# EAGLE board Erolf (EAGLE 6.5.0)
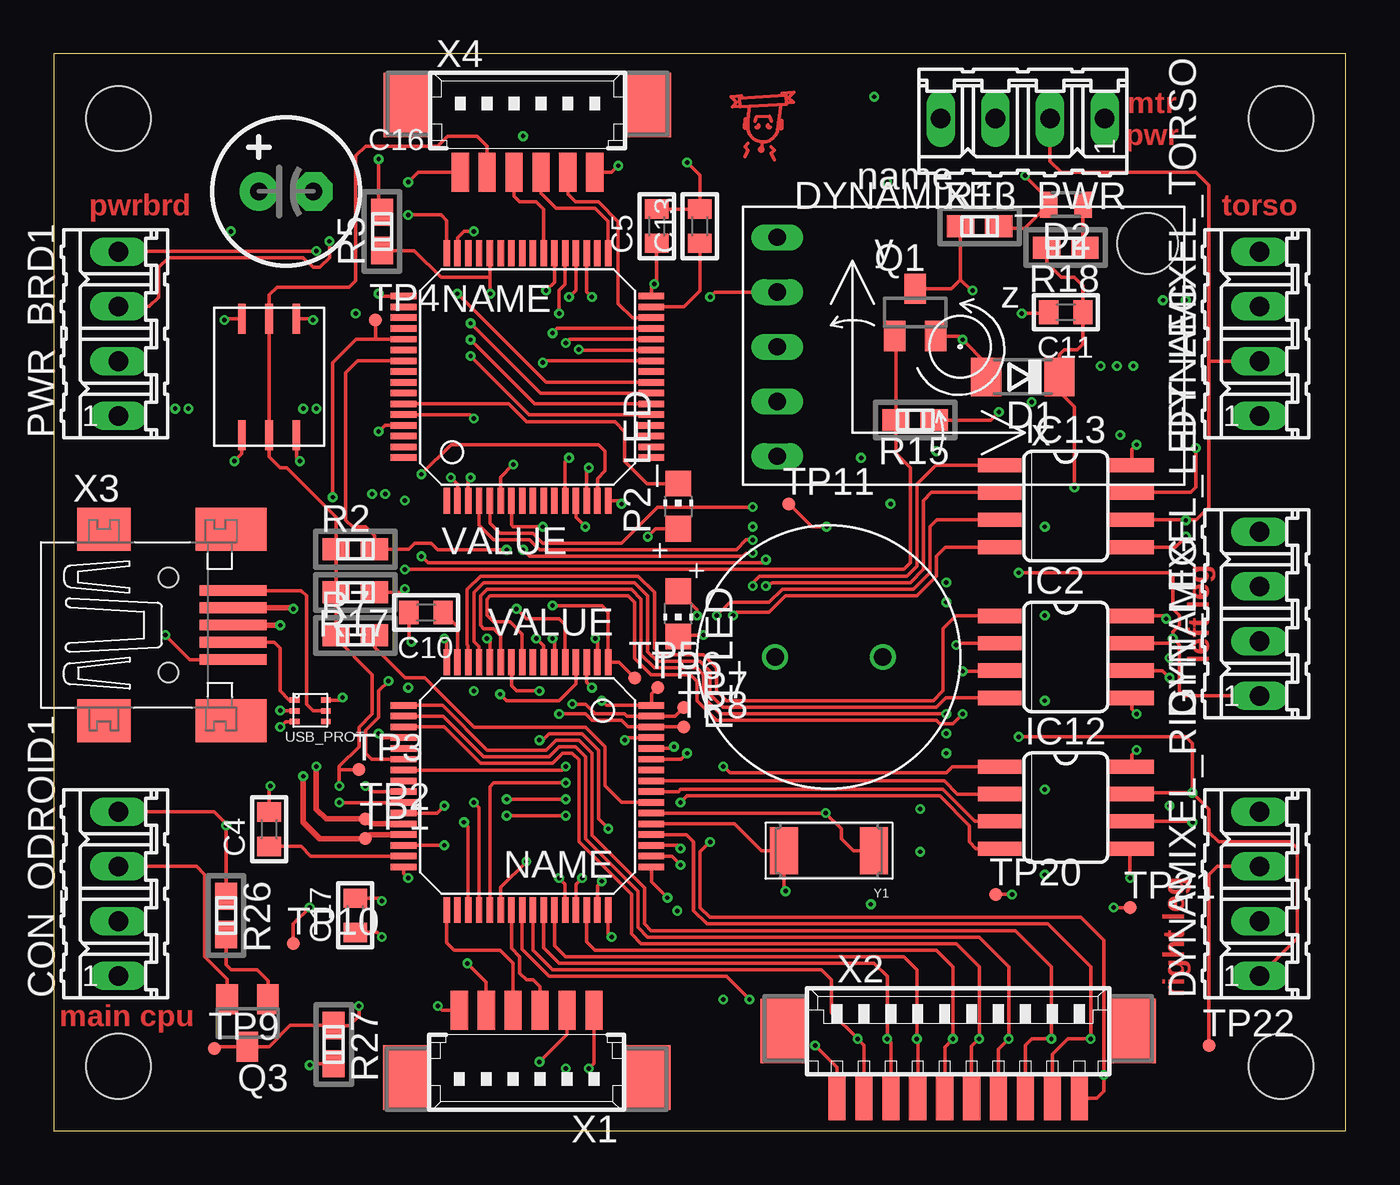
[diagram p13: board, top side]
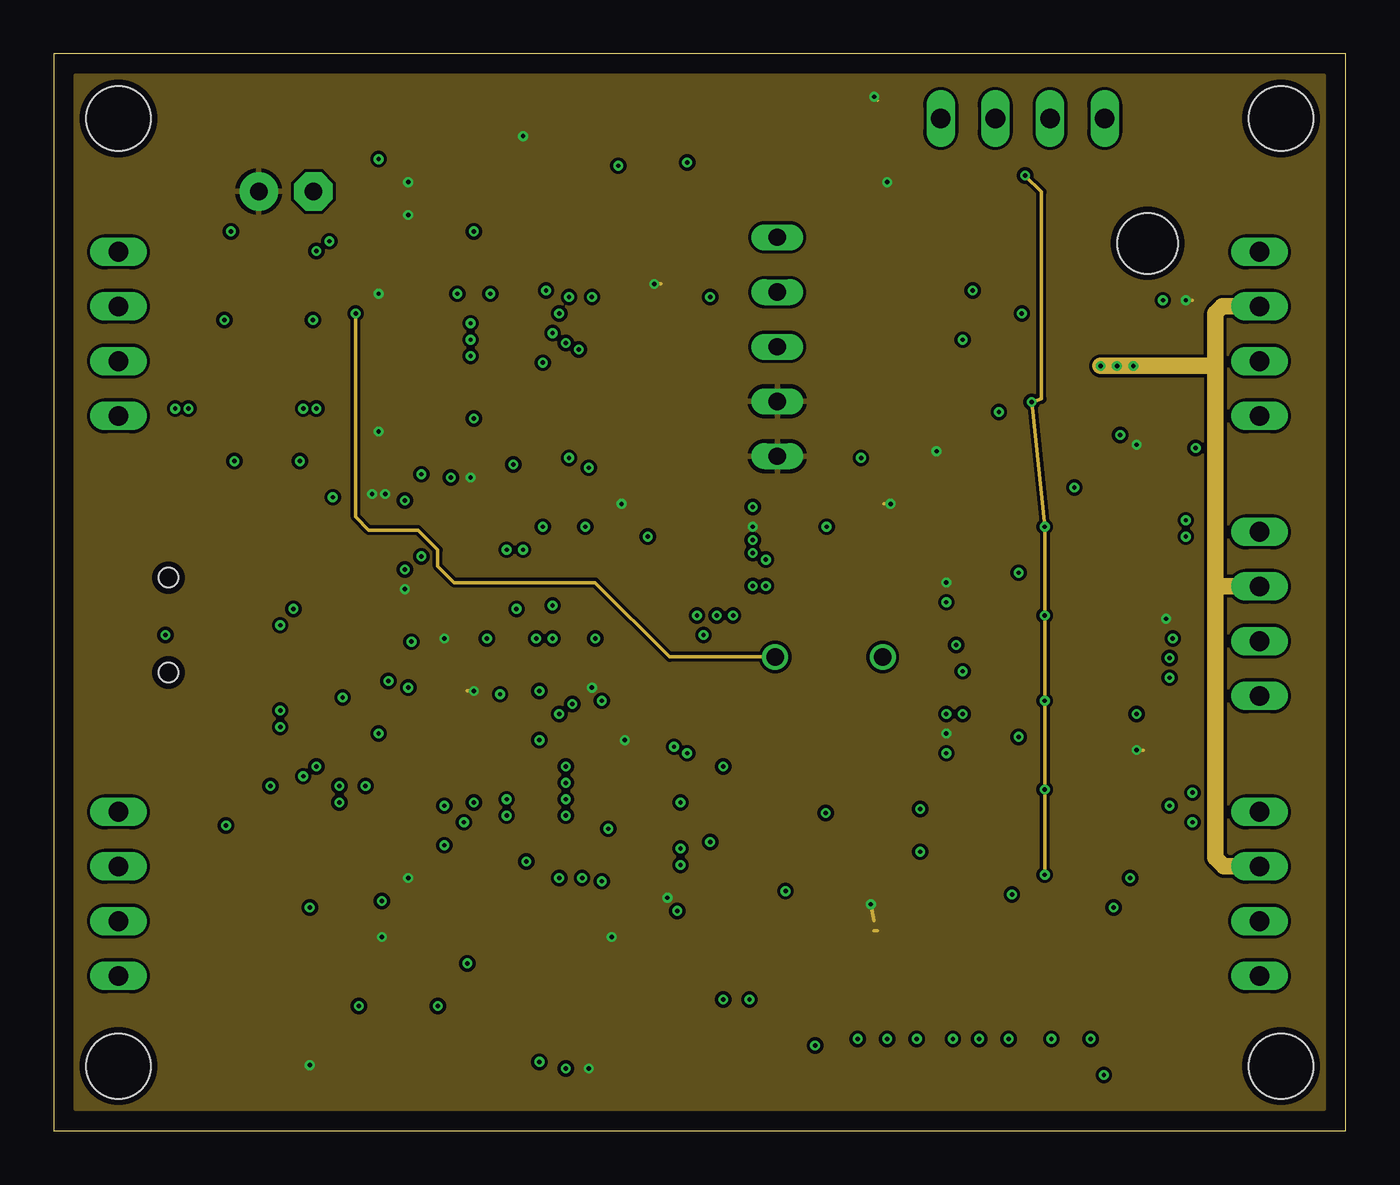
[diagram p14: board, inner layer Route2]
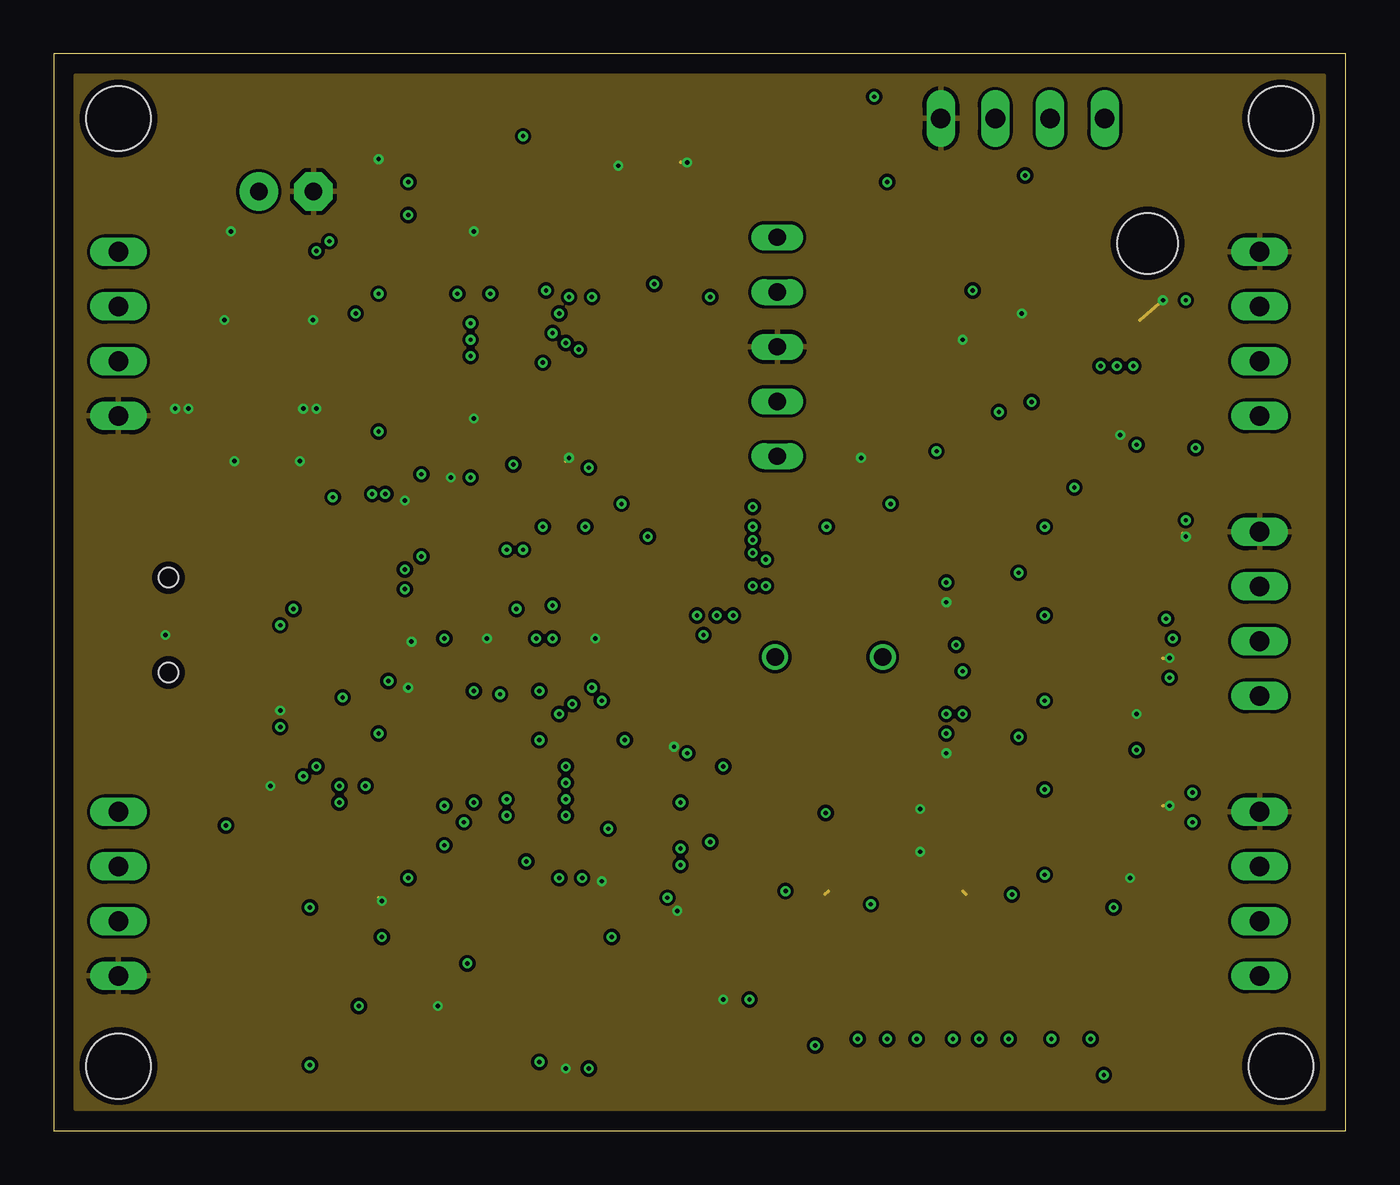
[diagram p15: board, inner layer Route15]
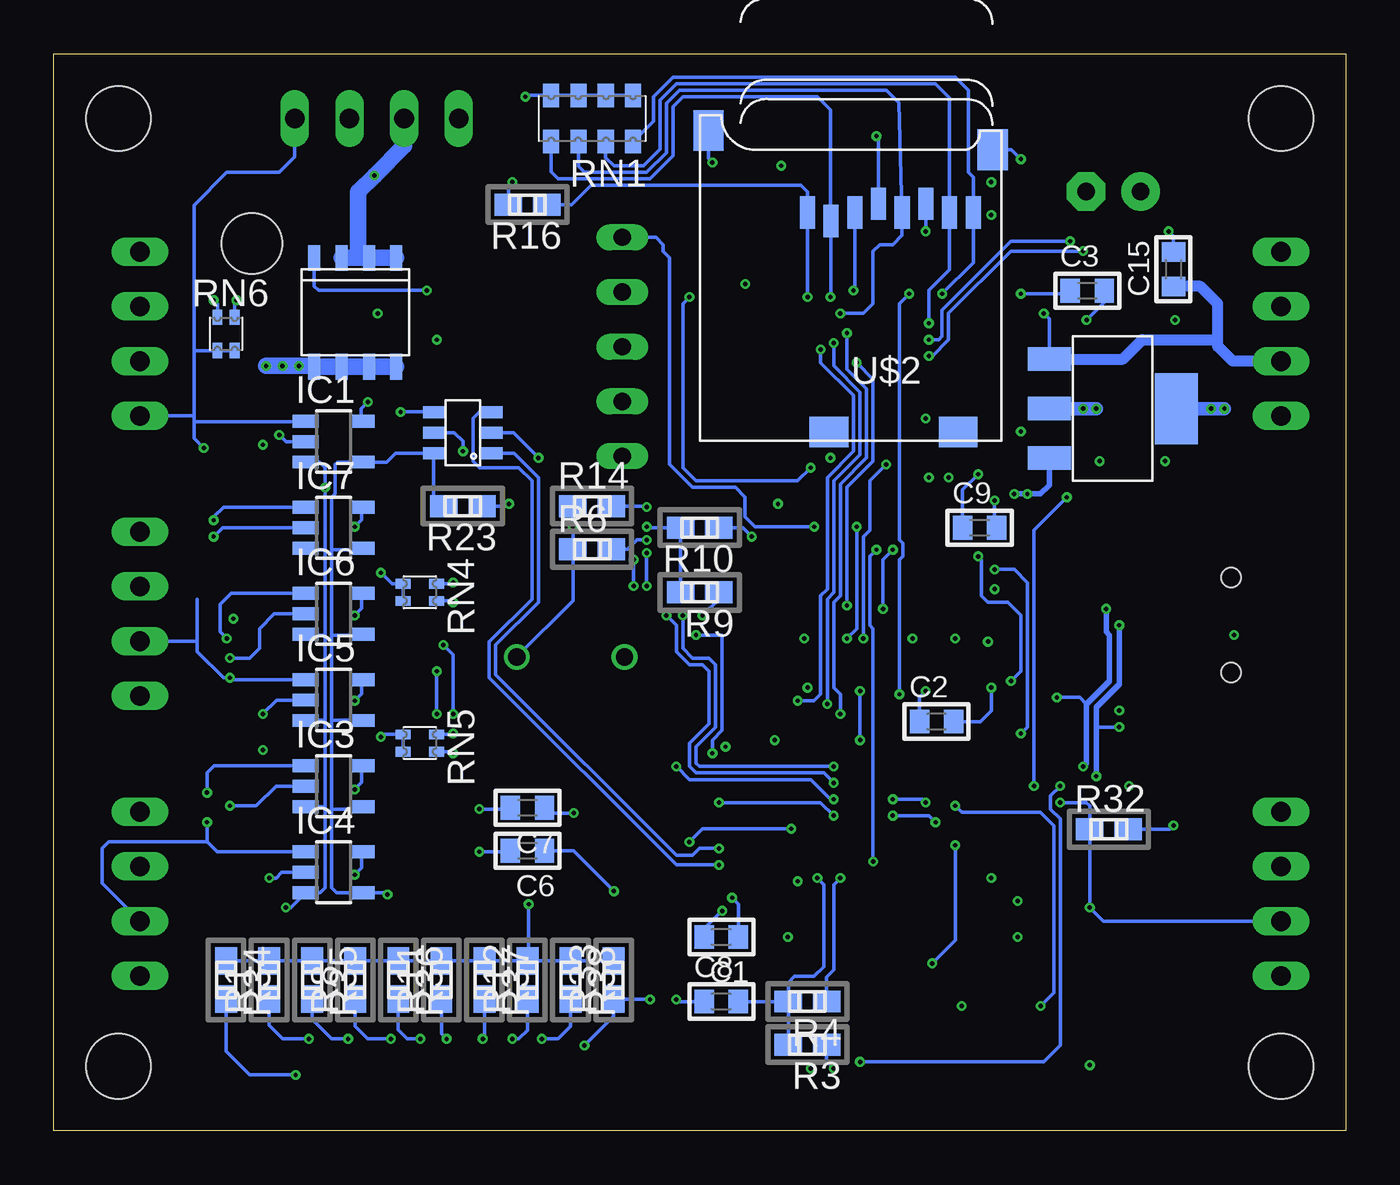
[diagram p16: board, bottom side, seen from below]

Size 60 x 50 mm. Coordinates in mm from the lower left corner, seen from the top.
Outline: 0,0 60,0 60,50 0,50 0,0
Copper layers (1+2*15+16): Top 0.035mm / dielectric 0.38mm / Route2 0.035mm / dielectric 0.71mm / Route15 0.035mm / dielectric 0.38mm / Bottom 0.035mm
Design rules "PCB-POOL HighSpec_ML4": minimum track width 0.125mm, minimum drill 0.2mm, track to track 0.125mm, track to pad 0.125mm, pad to pad 0.125mm, via to via 0.125mm, smd to smd 0.125mm, copper to edge 0.3mm, drill to drill 0.2mm, minimum pad ring 0.2mm, minimum via ring 0.125mm, stop-mask expansion 0.075mm, vias tented up to drill 0mil, thermal gap 0.2mm
Net classes: 0 default: width 0.152 mm, drill 0.203 mm, clearance 0.152 mm; 1 supply_bat: width 1.651 mm, drill 0.203 mm, clearance 0.152 mm
Holes 3 mm at 3,47 3,3 57,3 57,47

## Footprints (pad centres in the part's own frame; a part is rotated, then mirrored left to right if it is on the bottom)
SOT223-4 = smd 1.1 x 2: 1 -2.3,-2.95; 2 0,-2.95; 3 2.3,-2.95 | smd 3.3 x 2: 4 0,2.95
C0603 = smd 0.9 x 1.1: 1 -0.794,0; 2 0.794,0
CE-025X060 = drill 0.813 pad 1.778: + -1.27,0 | drill 0.813 pad 1.778 octagon: - 1.27,0
04P = drill 0.914 long: 1 -3.81,0; 2 -1.27,0; 3 1.27,0; 4 3.81,0
SOD80C = smd 1.4 x 1.8: A 1.7,0; C -1.7,0
MICROMELF-R = smd 0.8 x 1.2: A 0.8,0; C -0.8,0
DBV-R-PDSO-G5 = smd 0.6 x 1.2: 1 -0.95,-1.306; 2 0,-1.306; 3 0.95,-1.306; 4 0.95,1.306; 5 -0.95,1.306
SO08 = smd 0.66 x 2.032: 1 -1.905,-3.073; 2 -0.635,-3.073; 3 0.635,-3.073; 4 1.905,-3.073; 5 1.905,3.073; 6 0.635,3.073; 7 -0.635,3.073; 8 -1.905,3.073
CHIP-LED0805 = smd 1.2 x 1.2: A 0,-1.05; C 0,1.05
LQFP-64 = smd 0.3 x 1.2: BOOT0 -1.75,5.75; PA3 -3.75,-5.75; PA4 -2.25,-5.75; PA5 -1.75,-5.75; PA6 -1.25,-5.75; PA7 -0.75,-5.75; PA14 3.75,5.75; PA15 3.25,5.75; PB0 0.75,-5.75; PB1 1.25,-5.75; PB2 1.75,-5.75; PB3 0.75,5.75; PB4 0.25,5.75; PB5 -0.25,5.75; PB6 -0.75,5.75; PB7 -1.25,5.75; PB8 -2.25,5.75; PB9 -2.75,5.75; PB10 2.25,-5.75; PB11 2.75,-5.75; PC4 -0.25,-5.75; PC5 0.25,-5.75; PC10 2.75,5.75; PC11 2.25,5.75; PC12 1.75,5.75; PD2 1.25,5.75; VCAP_1 3.25,-5.75; VDD -2.75,-5.75; VDD1 3.75,-5.75; VDD3 -3.75,5.75; VSS -3.25,5.75; VSS0 -3.25,-5.75 | smd 1.2 x 0.3: NRST -5.75,0.75; PA0 -5.75,-2.75; PA1 -5.75,-3.25; PA2 -5.75,-3.75; PA8 5.75,0.25; PA9 5.75,0.75; PA10 5.75,1.25; PA11 5.75,1.75; PA12 5.75,2.25; PA13 5.75,2.75; PB12 5.75,-3.75; PB13 5.75,-3.25; PB14 5.75,-2.75; PB15 5.75,-2.25; PC0 -5.75,0.25; PC1 -5.75,-0.25; PC2 -5.75,-0.75; PC3 -5.75,-1.25; PC6 5.75,-1.75; PC7 5.75,-1.25; PC8 5.75,-0.75; PC9 5.75,-0.25; PC13 -5.75,3.25; PC14 -5.75,2.75; PC15 -5.75,2.25; PH0 -5.75,1.75; PH1 -5.75,1.25; VBAT -5.75,3.75; VCAP_2 5.75,3.25; VDD2 5.75,3.75; VDDA -5.75,-2.25; VSSA -5.75,-1.75
SOT23 = smd 1 x 1.4: 1 -0.95,-1.1; 2 0.95,-1.1; 3 0,1.1
R0603 = smd 1.27 x 1.016: 1 -0.889,0; 2 0.889,0
EXBS8V = smd 0.75 x 1.1: 1 -1.905,-1.07; 2 -0.635,-1.07; 3 0.635,-1.07; 4 1.905,-1.07; 5 1.905,1.07; 6 0.635,1.07; 7 -0.635,1.07; 8 -1.905,1.07
EXBV4V = smd 0.45 x 0.7: 1 -0.4,-0.775; 2 0.4,-0.775; 3 0.4,0.775; 4 -0.4,0.775
TP06R = smd 0.6 x 0.6: TP 0,0
PS1240P02CT3 = drill 0.8: P$1 -2.5,0; P$2 2.5,0
MICROSD = smd 0.7 x 1.5: 1 9,-10.64; 2 7.9,-10.24; 3 6.8,-10.64; 4 5.7,-11.04; 5 4.6,-10.64; 6 3.5,-11.04; 7 2.4,-10.64; 8 1.3,-10.64 | smd 1.8 x 1.4: CD1 2,-0.44; CD2 8,-0.44 | smd 1.4 x 1.9: MT1 0.4,-13.54; MT2 13.6,-14.44
BUTTON = smd 1.4 x 0.35: P11 -2.7,0; P12 2.7,0; P21 -2.7,1.27; P22 2.7,1.27; P23 2.7,-1.27; P24 -2.7,-1.27
PCB = drill 0.8 long: GND 1.6,6.4; SCL 1.6,11.48; SDA 1.6,8.94; VDD 1.6,1.32; VIN 1.6,3.86 | hole 2.8: 18.8,11.2
SO-8 = smd 0.559 x 1.194: P1 -1.905,-2.527; P2 -0.635,-2.527; P3 0.635,-2.527; P4 1.905,-2.527; P5 1.905,2.527; P6 0.635,2.527; P7 -0.635,2.527; P8 -1.905,2.527
DCV_R-PDSO-6 = smd 0.55 x 1: P$1 -0.95,-1.35; P$2 0,-1.35; P$3 0.95,-1.35; P$4 0.95,1.35; P$5 0,1.35; P$6 -0.95,1.35
LLP75-6L = smd 0.45 x 0.25: P$1 -0.7,1.1; P$2 -0.7,0.6; P$3 -0.7,0.1; P$4 0.75,0.1; P$5 0.75,0.6; P$6 0.75,1.1
53398-06 = smd 0.8 x 1.8: 1 3.125,-2.5; 2 1.875,-2.5; 3 0.625,-2.5; 4 -0.625,-2.5; 5 -1.875,-2.5; 6 -3.125,-2.5 | smd 2.1 x 3: S1 5.625,0.625; S2 -5.625,0.625
53261-10 = smd 0.8 x 2: 1 5.625,-2.5; 2 4.375,-2.5; 3 3.125,-2.5; 4 1.875,-2.5; 5 0.625,-2.5; 6 -0.625,-2.5; 7 -1.875,-2.5; 8 -3.125,-2.5; 9 -4.375,-2.5; 10 -5.625,-2.5 | smd 2.1 x 3: S1 8.125,0.625; S2 -8.125,0.625
32005-301 = smd 3.1 x 0.5: 1 3,1.6; 2 3,0.8; 3 3,0; 4 3,-0.8; 5 3,-1.6 | smd 2.5 x 2: M1 -3,-4.45; M2 -3,4.45 | smd 3.3 x 2: M3 2.9,4.45; M4 2.9,-4.45 | hole 0.9: 0,2.2; 0,-2.2
CRYSTAL_4.9X1.8 = smd 1.3 x 2.2: 1 -2.1,0; 2 2.1,0

## Placement (x,y rotation side)
BLUBB  [SOT223-4]  10.82,33.53 270 bottom
C1  2.2uF  [C0603]  29,9 180 bottom
C2  2.2uF  [C0603]  19,19 0 bottom
C3  2.2uF  [C0603]  12,39 0 bottom
C4  2.2uF  [C0603]  10,14 90 top
C5  2.2uF  [C0603]  28,42 90 top
C6  22pF  [C0603]  38,13 180 bottom
C7  22pF  [C0603]  38,15 180 bottom
C8  100nF  [C0603]  29,6 0 bottom
C9  2.2uF  [C0603]  17,28 0 bottom
C10  2.2uF  [C0603]  17.29,24.06 180 top
C11  100nF  [C0603]  47,38 180 top
C13  2.2uF  [C0603]  30,42 90 top
C15  100nF  [C0603]  8,40 90 bottom
C16  10uF  [CE-025X060]  10.79,43.61 0 top
C17  100nF  [C0603]  14,10 90 top
CON_ODROID1  [04P]  3,11 90 top
D1  [SOD80C]  45,35 180 top
D2  [MICROMELF-R]  47,43 180 top
DYNAMIXEL_LEFT_LEG  [04P]  56,24 90 top
DYNAMIXEL_PWR  [04P]  45,47 180 top
DYNAMIXEL_RIGHT_LEG  [04P]  56,11 90 top
DYNAMIXEL_TORSO  [04P]  56,37 90 top
IC1  TL331  [DBV-R-PDSO-G5]  47,32 270 bottom
IC2  MAX481CSA  [SO08]  47,22 270 top
IC3  TL331  [DBV-R-PDSO-G5]  47,16 270 bottom
IC4  TL331  [DBV-R-PDSO-G5]  47,12 270 bottom
IC5  TL331  [DBV-R-PDSO-G5]  47,20 270 bottom
IC6  TL331  [DBV-R-PDSO-G5]  47,24 270 bottom
IC7  TL331  [DBV-R-PDSO-G5]  47,28 270 bottom
IC12  MAX481CSA  [SO08]  47,15 270 top
IC13  MAX481CSA  [SO08]  47,29 270 top
P1_LED  [CHIP-LED0805]  29,24 180 top
P2_LED  [CHIP-LED0805]  29,29 0 top
PROCESSOR_1  STM32-F405RB  [LQFP-64]  22,16 180 top
PROCESSOR_2  STM32-F405RB  [LQFP-64]  22,35 0 top
PWR_BRD1  [04P]  3,37 90 top
Q1  BSS123  [SOT23]  40,38 0 top
Q3  [SOT23]  9,5 180 top
R1  330R  [R0603]  50,7 90 bottom
R2  47k  [R0603]  14,27 0 top
R3  100k  [R0603]  25,4 180 bottom
R4  1k  [R0603]  25,6 180 bottom
R5  10k  [R0603]  15.24,41.76 90 top
R6  330R  [R0603]  35,27 0 bottom
R7  47k  [R0603]  14,23 0 top
R8  330R  [R0603]  46,7 90 bottom
R9  330R  [R0603]  30,25 180 bottom
R10  330R  [R0603]  30,28 180 bottom
R11  330R  [R0603]  42,7 90 bottom
R12  330R  [R0603]  38,7 90 bottom
R13  10kR  [R0603]  43,42 0 top
R14  330R  [R0603]  35,29 0 bottom
R15  1kR  [R0603]  40,33 180 top
R16  33kR  [R0603]  38,43 180 bottom
R17  10k  [R0603]  14,25 180 top
R18  10kR  [R0603]  47,41 180 top
R23  10kR  [R0603]  41,29 180 bottom
R26  0k  [R0603]  8,10 270 top
R27  5k  [R0603]  13,4 270 top
R32  5k  [R0603]  11,14 0 bottom
R33  330R  [R0603]  34,7 90 bottom
R34  10kR  [R0603]  52,7 270 bottom
R35  10kR  [R0603]  48,7 270 bottom
R36  10kR  [R0603]  44,7 270 bottom
R37  10kR  [R0603]  40,7 270 bottom
R38  10kR  [R0603]  36,7 270 bottom
RN1  33kR  [EXBS8V]  35,47 180 bottom
RN4  10k  [EXBV4V]  43,25 270 bottom
RN5  10k  [EXBV4V]  43,18 270 bottom
RN6  10k  [EXBV4V]  52,37 0 bottom
TP1  PTR1TP06R  [TP06R]  14.48,13.56 0 top
TP2  PTR1TP06R  [TP06R]  14.48,14.48 0 top
TP3  PTR1TP06R  [TP06R]  14.17,16.76 0 top
TP4  PTR1TP06R  [TP06R]  14.94,37.64 0 top
TP5  PTR1TP06R  [TP06R]  26.97,21.03 0 top
TP6  PTR1TP06R  [TP06R]  28.04,20.57 0 top
TP7  PTR1TP06R  [TP06R]  29.26,19.66 0 top
TP8  PTR1TP06R  [TP06R]  29.26,18.75 0 top
TP9  PTR1TP06R  [TP06R]  7.47,3.81 0 top
TP10  PTR1TP06R  [TP06R]  11.13,8.69 0 top
TP11  PTR1TP06R  [TP06R]  34.14,29.11 0 top
TP20  PTR1TP06R  [TP06R]  43.74,10.97 0 top
TP21  PTR1TP06R  [TP06R]  49.99,10.36 0 top
TP22  PTR1TP06R  [TP06R]  53.64,3.96 0 top
U$1  [PS1240P02CT3]  36,22 0 top
U$2  MICROSD  [MICROSD]  16,32 180 bottom
U$3  [BUTTON]  10,35 270 top
U$4  MINI-IMU-9V2  [PCB]  32,30 0 top
U$6  SI4459ADY  [SO-8]  46,38 180 bottom
U$7  [DCV_R-PDSO-6]  41.01,32.41 90 bottom
U$8  [LOGO]  32.96,46.83 180 top
USB_PROT  VBUS054B  [LLP75-6L]  11.89,18.9 0 top
X1  53398-06  [53398-06]  21.96,3.09 180 top
X2  53261-10  [53261-10]  42,4 0 top
X3  MINI-USB-32005-301  [32005-301]  5.33,23.48 0 top
X4  53398-06  [53398-06]  22,47 0 top
Y1  8MHz  [CRYSTAL_4.9X1.8]  36,13 180 top

## Tracks (layer width: path | path; a pad name or v marks a point on that pad's centre or on a via)
BOOT0_CHARGE_P1  (via drill 0.2)
  Top 0.152: PROCESSOR_1.PB8 24.25,11.45 v24.54,11.73
  Bottom 0.152: v24.54,11.73 24.23,11.43 24.23,7.62 24.69,7.16 25.6,7.16 25.89,6.88 R4.2 | C8.2 R4.2 | R4.2 R3.2
BOOT_P2  (via drill 0.2)
  Top 0.152: PROCESSOR_2.BOOT0 20.25,39.62 | 20.25,39.62 20.25,38.88 v20.27,38.86 | PROCESSOR_1.PA4 24.25,20.75 23.47,19.96 21.03,19.96 v20.73,20.27 | R5.1 16.74,40.87 17.98,39.62 20.25,39.62
  Bottom 0.152: v20.27,38.86 20.73,38.41 20.73,27.43 20.57,27.28 20.57,26.67 20.73,26.52 v20.73,20.27
DYNAMIXEL_BUS_OFF  (via drill 0.2)
  Top 0.152: Q1.1 39.11,36.84 R15.2 39.11,31.45 39.78,30.79 39.78,26.36 39.47,26.06 v16.31,26.06 | PROCESSOR_1.PB15 15.28,18.25 v15.09,18.44
  Bottom 0.152: v15.09,18.44 14.78,18.75 14.78,25.45 15.39,26.06 v16.31,26.06
DYNAMIXEL_BUS_OFF_AUTO_TRIG  (via drill 0.2)
  Top 0.152: TP20.TP v44.5,10.97
  Bottom 0.152: 47.09,14.94 47.09,11.28 46.86,11.05 IC4.4 44.58,11.05 v44.5,10.97 | 47.09,14.94 47.09,19.05 | 47.09,19.05 47.09,23.01 | 47.09,23.01 47.09,26.98 | 47.09,26.98 47.09,29.41 46.94,29.57 46.94,30.94 46.83,31.05 IC1.4 44.54,31.05 44.13,31.46 U$7.P$6 42.36,29.47 R23.2 | IC5.4 47.09,19.05 | IC3.4 45.81,14.94 47.09,14.94 | IC6.4 45.73,23.01 47.09,23.01 | IC7.4 45.77,26.98 47.09,26.98
DYNAMIXEL_LEFT_LEG_A  (via drill 0.2)
  Top 0.152: IC2.6 51.48,21.36 v51.82,21.03
  Bottom 0.152: 53.34,24.69 53.34,22.71 | 53.34,22.71 53.34,22.25 52.12,21.03 v51.82,21.03 51.73,20.95 IC5.1 48.38,20.88 | DYNAMIXEL_LEFT_LEG.2 53.36,22.73 53.34,22.71
DYNAMIXEL_LEFT_LEG_B  (via drill 0.2)
  Top 0.152: IC2.7 51.74,22.64 v51.97,22.86 | v44.81,25.91 51.82,25.91 51.97,25.76 51.97,24.23 52.27,23.93 52.27,23.47 51.97,23.16 v51.97,22.86 | DYNAMIXEL_LEFT_LEG.1 52.51,20.19 52.27,20.42 52.27,22.55 v51.97,22.86
  Bottom 0.152: IC6.1 51.77,24.95 52.27,24.45 52.27,23.16 v51.97,22.86 | RN4.2 RN4.1 44.3,25.4 v44.81,25.91
DYNAMIXEL_LEFT_LEG_DXE  (via drill 0.2)
  Top 0.152: PROCESSOR_1.PC5 21.75,23.06 21.18,23.62 20.42,23.62 20.12,23.93 20.12,24.69 20.27,24.84 26.67,24.84 26.98,24.54 26.98,21.95 27.74,21.18 29.57,21.18 29.87,20.88 29.87,19.96 30.79,19.05 41,19.05 41.15,18.9 41.76,18.9 v42.22,19.36 | v42.22,21.34 43.9,21.34 IC2.3
  Bottom 0.152: v42.22,19.36 v42.22,21.34
DYNAMIXEL_LEFT_LEG_RX
  Top 0.152: IC2.1 41.89,23.91 41.3,23.32 41.3,20.42 40.84,19.96 31.24,19.96 30.79,20.42 30.79,21.49 30.18,22.1 28.19,22.1 27.89,22.4 27.89,24.99 27.13,25.76 19.81,25.76 19.2,25.15 19.2,22.55 19.25,22.51 PROCESSOR_1.PB11
DYNAMIXEL_LEFT_LEG_RXE  (via drill 0.2)
  Top 0.152: PROCESSOR_1.PB1 20.75,22.99 20.42,23.32 19.96,23.32 19.81,23.47 19.81,24.84 20.12,25.15 26.82,25.15 27.28,24.69 27.28,22.1 27.89,21.49 29.87,21.49 30.18,21.18 30.18,20.12 30.94,19.36 v41.45,19.36 | v41.91,22.55 41.99,22.64 IC2.2
  Bottom 0.152: v41.45,19.36 41.45,22.1 v41.91,22.55
DYNAMIXEL_LEFT_LEG_TX
  Top 0.152: PROCESSOR_1.PB10 19.75,22.46 19.51,22.71 19.51,24.99 19.96,25.45 26.98,25.45 27.58,24.84 27.58,22.25 28.04,21.79 30.02,21.79 30.48,21.34 30.48,20.27 31.09,19.66 41,19.66 41.43,20.09 IC2.4
DYNAMIXEL_PWR_RST_CLK  (via drill 0.2)
  Top 0.152: PROCESSOR_1.PC14 28.96,13.25 v29.11,13.11
  Bottom 0.152: v29.11,13.11 30.02,13.11 30.33,12.8 31.09,12.8 39.47,21.18 39.47,22.55 37.49,24.54 37.49,30.33 38.62,31.46 U$7.P$1
DYNAMIXEL_PWR_RST_D  (via drill 0.2)
  Top 0.152: PROCESSOR_1.PC13 28.7,12.75 v29.11,12.34
  Bottom 0.152: v29.11,12.34 31.09,12.34 39.78,21.03 39.78,22.71 37.8,24.69 37.8,30.18 38.41,30.79 40.23,30.79 40.54,31.09 40.54,33.07 40.25,33.36 U$7.P$3
DYNAMIXEL_RIGHT_LEG_A  (via drill 0.2)
  Top 0.152: IC12.6 52.84,14.37 v52.88,14.33
  Bottom 0.152: IC4.1 52.42,12.95 52.88,13.41 | 52.88,13.41 v52.88,14.33 | 52.88,13.41 57.45,13.41 57.76,13.11 57.76,11.49 DYNAMIXEL_RIGHT_LEG.2
DYNAMIXEL_RIGHT_LEG_B  (via drill 0.2)
  Top 0.152: v44.81,18.29 52.58,18.29 52.88,17.98 v52.88,15.7 | DYNAMIXEL_RIGHT_LEG.1 57.76,8.95 57.76,13.11 57.45,13.41 54.1,13.41 53.65,13.87 53.65,14.94 v52.88,15.7 | IC12.7 50.14,15.7 v52.88,15.7
  Bottom 0.152: v44.81,18.29 44.69,18.4 RN5.1 RN5.2 | IC3.1 52.54,16.95 52.88,16.61 v52.88,15.7
DYNAMIXEL_RIGHT_LEG_DXE
  Top 0.152: IC12.3 42.78,14.37 41.3,15.85 29.11,15.85 29.01,15.75 PROCESSOR_1.PC0
DYNAMIXEL_RIGHT_LEG_RX  (via drill 0.2)
  Top 0.152: IC12.1 41.75,16.91 41.45,16.61 31.39,16.61 v31.09,16.92 | v23.77,15.39 v21.03,15.39 | v19.51,15.24 19.75,15 PROCESSOR_1.PC11
  Bottom 0.152: v31.09,16.92 30.48,16.31 24.84,16.31 23.93,15.39 v23.77,15.39 | v21.03,15.39 19.66,15.39 v19.51,15.24
DYNAMIXEL_RIGHT_LEG_RXE
  Top 0.152: PROCESSOR_1.PC1 41.36,16.25 41.97,15.63 IC12.2
DYNAMIXEL_RIGHT_LEG_TX  (via drill 0.2)
  Top 0.152: IC12.4 42.84,13.1 42.52,13.41 42.52,14.17 41.15,15.54 29.41,15.54 v29.11,15.24 | v23.77,14.63 v21.03,14.63 | v19.05,14.33 19.25,14.13 PROCESSOR_1.PC10
  Bottom 0.152: v29.11,15.24 24.38,15.24 v23.77,14.63 | v21.03,14.63 19.36,14.63 v19.05,14.33
DYNAMIXEL_TORSO_A  (via drill 0.2)
  Top 0.152: 52.58,28.36 53.05,28.36 53.65,28.96 53.65,35.66 | 52.58,28.36 IC13.6 | v52.58,28.35 52.58,28.36 | 53.65,35.66 53.65,43.89 53.03,44.5 46.79,44.5 46.27,45.02 DYNAMIXEL_PWR.2 | DYNAMIXEL_TORSO.2 53.71,35.73 53.65,35.66
  Bottom 0.152: IC7.1 52.12,28.96 52.58,28.5 v52.58,28.35
DYNAMIXEL_TORSO_B  (via drill 0.2)
  Top 0.152: IC13.7 52.8,29.64 53.03,29.87 v53.03,31.7
  Bottom 0.152: 53.49,36.23 RN6.1 RN6.2 | IC1.1 48.33,32.95 48.36,32.92 53.49,32.92 | v53.03,31.7 53.49,32.16 53.49,32.92 | 53.49,32.92 53.49,33.22 | 53.49,33.22 53.49,36.23 | DYNAMIXEL_TORSO.1 53.53,33.19 53.49,33.22 | 53.49,36.23 53.49,42.98 51.97,44.5 49.53,44.5 48.81,45.22 DYNAMIXEL_PWR.1
DYNAMIXEL_TORSO_DXE  (via drill 0.2)
  Top 0.152: IC13.3 41.01,28.36 40.69,28.04 40.69,25.91 39.93,25.15 33.83,25.15 33.22,24.54 31.39,24.54 v30.79,23.93 | v23.77,16.92 23.61,16.75 PROCESSOR_1.PC8
  Bottom 0.152: v30.79,23.93 30.79,22.4 30.33,21.95 29.57,21.95 29.26,21.64 29.26,18.75 30.18,17.83 30.18,17.07 30.02,16.92 v23.77,16.92
DYNAMIXEL_TORSO_RX  (via drill 0.2)
  Top 0.152: IC13.1 40.96,30.91 40.08,30.02 40.08,26.21 39.62,25.76 32.77,25.76 32.46,25.45 v32.46,25.3 | v32.46,26.82 32.16,26.82 32,26.67 22.1,26.67 v21.79,26.98 | v21.95,12.5 20.75,11.3 PROCESSOR_1.PD2
  Bottom 0.152: v32.46,25.3 v32.46,26.82 | v21.79,26.98 22.1,26.67 22.1,23.47 21.95,23.32 v21.95,12.5
DYNAMIXEL_TORSO_RXE  (via drill 0.2)
  Top 0.152: IC13.2 40.76,29.64 40.39,29.26 40.39,26.06 39.78,25.45 33.38,25.45 v33.07,25.3 | v33.07,26.52 32.92,26.36 17.37,26.36 v17.07,26.67 | PROCESSOR_1.PC7 14.75,17.25 14.48,17.53 14.48,18.59 15.09,19.2 15.09,20.42 v15.54,20.88
  Bottom 0.152: v33.07,25.3 v33.07,26.52 | v17.07,26.67 16.92,26.52 16.92,24.84 16.61,24.54 15.7,24.54 15.09,23.93 15.09,21.34 v15.54,20.88
DYNAMIXEL_TORSO_TX  (via drill 0.2)
  Top 0.152: IC13.4 41.42,27.09 41,26.67 41,25.76 40.08,24.84 33.98,24.84 33.22,24.08 31.7,24.08 v31.55,23.93 | v23.77,16.15 20.42,16.15 20.25,15.98 PROCESSOR_1.PC12
  Bottom 0.152: v31.55,23.93 31.09,23.47 31.09,22.25 30.48,21.64 29.87,21.64 29.57,21.34 29.57,18.9 30.48,17.98 30.48,16.92 30.18,16.61 24.23,16.61 v23.77,16.15
GND  (via drill 0.2)
  Top 0.152: PROCESSOR_2.VSS 18.75,41.46 19.05,41.76 v19.51,41.76 | X4.1 25.91,44.5 v26.21,44.81 | U$3.P24 7.98,37.7 v7.92,37.64 | U$3.P21 11.98,37.7 v12.04,37.64 | U$3.P23 8.73,31.44 v8.38,31.09 | U$3.P22 11.27,31.25 v11.43,31.09 | PROCESSOR_2.VSSA 19.33,33.25 v19.51,33.07 | PROCESSOR_2.VSS0 18.75,30.02 v18.44,30.33 | PROCESSOR_2.PB2 23.75,31.07 v23.93,31.24 | Q1.2 42.04,36.9 v42.22,36.73 43.3,35.64 D1.A | IC13.5 52.09,27.09 v52.58,27.58 | v49.99,11.73 49.99,13.01 IC12.5 | IC2.5 50.07,19.57 v50.29,19.36 | PROCESSOR_1.PB2 20.25,22.73 v20.12,22.86 | PROCESSOR_1.VSS0 25.25,22.76 v25.15,22.86 | C17.2 15.11,10.79 v15.24,10.67 | X1.1 18.03,5.59 v17.83,5.79 | PROCESSOR_1.VSS 25.25,11.38 v25.45,11.58 | PROCESSOR_1.VSSA 28.72,17.75 v28.8,17.83 | v29.41,44.96 30,44.37 C13.2 C5.2 | C10.2 16.49,22.82 v16.61,22.71 | R5.2 15.09,42.8 v15.09,45.11 | C4.2 10,15.94 v10.06,16 | USB_PROT.P$2 11.33,19.51 v10.52,19.51 | X3.5 6.31,21.88 v5.18,23.01 | C11.2 46.15,37.95 v44.96,37.95
  Route2 0.152: v16.46,20.57 16.61,20.57
  Route15 0.152: v19.51,41.76 19.51,41.91 | v15.09,45.11 15.09,44.96 | v26.21,44.81 26.36,44.81 | v29.41,44.96 29.11,44.96 | v8.23,41.76 8.38,41.76 | v7.92,37.64 7.77,37.64 | v12.04,37.64 12.19,37.64 | v8.38,31.09 8.23,31.09 | v11.43,31.09 11.58,31.09 | v12.19,33.53 12.04,33.53 | v19.51,33.07 19.51,32.92 | v18.44,30.33 18.44,30.48 | v23.93,31.24 23.77,31.09 | v51.51,38.56 50.44,37.64 | v49.53,32.31 49.38,32.31 | v42.22,36.73 42.06,36.73 | v37.49,31.24 37.49,31.39 | v52.58,27.58 52.43,27.74 | v41.45,24.54 41.3,24.54 | v41.45,17.53 41.3,17.53 | 42.37,10.97 42.22,11.12 | v51.82,15.09 51.51,15.09 | v51.82,21.95 51.51,21.95 | v20.12,22.86 19.96,22.86 | v25.15,22.86 24.99,22.86 | v15.24,10.67 15.09,10.82 | v17.83,5.79 17.68,5.79 | v23.77,2.9 23.62,2.9 | v31.09,6.1 31.09,6.25 | v25.45,11.58 25.45,11.73 | v28.8,17.83 28.96,17.83 | 35.97,11.12 35.81,10.97
  Bottom 0.152: U$2.MT1 15.52,45.54 v15.09,45.11 | U$2.6 v19.5,41.77 v19.51,41.76 | U$2.MT2 29.6,45.15 v29.41,44.96 | C15.2 8,41.53 v8.23,41.76 | v11.58,33.53 v12.19,33.53 | IC1.2 49.22,32 v49.53,32.31 | U$7.P$2 38.66,32.41 v37.49,31.24 | IC7.2 52.16,28 v52.58,27.58 | RN4.3 41.52,24.6 v41.45,24.54 | RN5.3 41.53,17.6 v41.45,17.53 | IC3.2 49.68,16 50.6,15.09 v51.82,15.09 | v49.99,11.73 49.68,11.73 49.42,12 IC4.2 | v50.29,19.36 49.65,20 IC5.2 | IC6.2 49.76,24 50.44,23.32 50.44,22.4 50.9,21.95 v51.82,21.95 | R3.1 24.11,3.23 v23.77,2.9 | C8.1 30.99,6 v31.09,6.1 | RN6.3 51.6,38.47 v51.51,38.56 | C2.2 16.97,19 16.46,19.51 v16.46,20.57 | C9.2 16.31,28.1 v16.31,29.26 | C7.2 38.86,14.94 v40.23,14.94 | C6.2 38.84,12.95 v40.23,12.95 | C3.2 11.21,38.48 v12.04,37.64 | C1.2 29.79,9.37 v28.96,10.21
  Bottom 0.635: BLUBB.4 v5.64,33.53 | BLUBB.2 v11.58,33.53
  other vias: 6.25,33.53
  pour Route15 (isolate 0.152): 1,1 1,49 59,49 59,1
IMU_SCL  (via drill 0.2)
  Top 0.152: v24.69,28.04 24.25,28.48 PROCESSOR_2.PB10
  Bottom 0.152: U$4.SCL 32.03,41.48 31.7,41.15 31.7,40.84 31.39,40.54 31.39,30.94 30.33,29.87 28.35,29.87 27.89,29.41 27.89,28.5 27.43,28.04 v24.69,28.04
IMU_SDA  (via drill 0.2)
  Top 0.152: U$4.SDA 30.71,38.94 v30.48,38.71 | v24.84,30.79 24.75,30.69 PROCESSOR_2.PB11
  Bottom 0.152: v30.48,38.71 30.79,38.41 30.79,30.79 30.18,30.18 25.45,30.18 v24.84,30.79
MISC_3  (via drill 0.2)
  Top 0.152: PROCESSOR_1.PA6 23.25,22.77 v23.16,22.86 | v22.71,28.04 21.34,28.04 21.25,28.13 PROCESSOR_2.PA7
  Bottom 0.152: v23.16,22.86 22.71,23.32 v22.71,28.04
MISC_4  (via drill 0.2)
  Top 0.152: PROCESSOR_1.PA7 22.75,22.51 v22.4,22.86 | v21.34,30.94 20.75,30.35 PROCESSOR_2.PA6
  Bottom 0.152: v21.34,30.94 22.1,30.18 22.1,27.89 22.4,27.58 v22.4,22.86
N$1
  Top 0.152: C10.1 18.75,23.39 PROCESSOR_1.VCAP_1
N$2  (via drill 0.2)
  Top 0.152: R15.1 43.52,33 v43.89,33.38
  Bottom 0.152: v43.89,33.38 42.38,33.38 U$7.P$4
N$3  (via drill 0.2)
  Top 0.152: v29.87,23.93 29.87,24.18 P1_LED.A
  Bottom 0.152: R9.1 29.11,24.69 v29.87,23.93
N$4  (via drill 0.2)
  Top 0.152: P2_LED.A 27.95,27.95 v27.58,27.58
  Bottom 0.152: v27.58,27.58 28,28 R10.1
N$5  (via drill 0.2)
  Top 0.152: P1_LED.C 29.06,23.01 v30.18,23.01 | v29.41,17.53 29.14,17.25 PROCESSOR_1.PC3
  Bottom 0.152: v30.18,23.01 28.96,23.01 28.96,18.59 29.41,18.14 v29.41,17.53
N$7
  Top 0.152: C13.1 30,38.99 29.26,38.25 PROCESSOR_2.VCAP_2
N$8  (via drill 0.2)
  Top 0.152: PROCESSOR_2.VCAP_1 25.25,30.28 25.6,30.63 25.6,31.55 25.3,31.85 18.44,31.85 v17.07,30.48
  Bottom 0.152: v17.07,30.48 17.79,29.75 C9.1
N$9  (via drill 0.2)
  Top 0.152: PROCESSOR_1.BOOT0 23.75,11.45 v23.47,11.73
  Bottom 0.152: v23.47,11.73 23.77,11.43 23.77,7.47 24.11,7.13 R4.1
N$10
  Top 0.152: PROCESSOR_2.PC3 21.11,33.75 21.95,32.92 26.06,32.92 26.52,32.46 26.52,31.09 27.56,30.05 P2_LED.C
N$11  (via drill 0.2)
  Top 0.152: R13.1 42.11,39.52 | 42.11,39.52 41.69,39.1 Q1.3 | 42.11,39.52 42.62,39.01 v42.67,39.01
  Bottom 0.152: v42.67,39.01 47.7,39.01 47.91,39.22 U$6.P4
N$12
  Top 0.152: D2.C 47.8,41.09 R18.1
N$15
  Top 0.152: R26.2 8,7.7 8.23,7.47 9.45,7.47 9.95,6.97 Q3.1
N$43
  Top 0.152: PROCESSOR_1.VCAP_2 11.94,12.75 11.48,13.21 C4.1
NRST  (via drill 0.2)
  Top 0.152: R7.1 R17.2 R2.1 13.11,28.49 10.82,30.79 10.52,30.79 10,31.3 U$3.P12 U$3.P11 10,38.8 10.36,39.17 13.72,39.17 14.02,39.47 14.02,45.26 14.48,45.72 17.83,45.72 18.29,46.18 19.66,46.18 20.12,45.71 X4.5 | R7.1 12.95,22.84 | 13.26,16.76 v13.26,16 | v22.55,3.2 23.84,4.48 X1.5 | TP3.TP 13.26,16.76 | 13.26,16.76 13.26,16.92 14.17,17.83 14.17,18.75 14.78,19.36 14.78,21.18 13.11,22.86 R7.1
  Bottom 0.152: v13.26,16 13.72,15.54 13.72,14.94 13.26,14.48 13.26,3.96 14.02,3.2 v22.55,3.2
NRST_P1_SAV
  Top 0.152: PROCESSOR_1.NRST 26.38,15.25 25.6,16.02 25.6,17.83 24.69,18.75 19.51,18.75 17.22,21.03 16.31,21.03 14.89,22.45 R7.2
NRST_P2  (via drill 0.2)
  Top 0.152: PROCESSOR_2.NRST 14.11,35.75 13.56,35.2 13.56,28.35 13.87,28.04 14.48,28.04 14.89,27.63 R2.2 16.48,27 16.76,27.28 17.53,27.28 17.83,26.98 v21.03,26.98 | PROCESSOR_1.PA5 23.75,23.49 23.47,23.77 21.95,23.77 v21.49,24.23
  Bottom 0.152: v21.49,24.23 21.49,26.52 v21.03,26.98
OBC_P1_2_P2  (via drill 0.2)
  Top 0.152: PROCESSOR_2.PA10 24.41,36.25 v24.38,36.27 | v25.45,19.96 25.66,19.75 PROCESSOR_1.PA2 27.75,20.28 TP6.TP
  Bottom 0.152: v24.38,36.27 24.38,35.66 22.86,34.14 22.86,31.55 24.08,30.33 24.08,25.15 24.38,24.84 24.38,20.27 24.69,19.96 v25.45,19.96
OBC_P2_2_P1  (via drill 0.2)
  Top 0.152: v23.16,24.38 25.45,24.38 25.75,24.09 PROCESSOR_1.PA3 26.26,21.75 TP5.TP | v22.71,35.66 22.8,35.75 PROCESSOR_2.PA9
  Bottom 0.152: v23.16,24.38 23.16,29.87 21.95,31.09 21.95,34.9 v22.71,35.66
OSC_IN  (via drill 0.2)
  Top 0.152: PROCESSOR_1.PH0 31.62,14.25 32.87,13 Y1.2 33.9,11.21 v33.98,11.12
  Bottom 0.152: C6.1 35.86,13 v33.98,11.12
OSC_OUT  (via drill 0.2)
  Top 0.152: PROCESSOR_1.PH1 v35.85,14.75 36.58,14.02 36.58,13.56 37.14,13 Y1.1
  Bottom 0.152: C7.1 36.96,14.75 v35.85,14.75
P1_SGN_PCKT  (via drill 0.2)
  Top 0.152: PROCESSOR_2.PA11 23.95,36.75 v23.77,36.58 | v24.08,19.81 24.69,19.81 25.15,19.36 26.52,19.36 26.62,19.25 PROCESSOR_1.PA1 28.85,19.25 TP7.TP
  Bottom 0.152: v23.77,36.58 23.77,35.51 22.55,34.29 22.55,31.39 23.77,30.18 23.77,24.99 24.08,24.69 v24.08,19.81
P2_SGN_PCKT  (via drill 0.2)
  Top 0.152: PROCESSOR_2.PA12 23.38,37.25 v23.16,37.03 | v23.47,19.36 24.69,19.36 24.99,19.05 26.36,19.05 26.66,18.75 PROCESSOR_1.PA0 TP8.TP
  Bottom 0.152: v23.16,37.03 23.16,35.36 22.25,34.44 22.25,31.24 23.47,30.02 23.47,24.84 23.77,24.54 23.77,20.57 23.47,20.27 v23.47,19.36
PWR_BRD_RX  (via drill 0.2)
  Top 0.152: PWR_BRD1.3 4.44,38.27 4.88,38.71 4.88,40.08 5.33,40.54 11.58,40.54 12.04,40.08 12.34,40.08 12.8,40.54 v12.8,41.3 | v19.36,36.73 22.33,33.75 PROCESSOR_2.PC7
  Bottom 0.152: v12.8,41.3 15.54,41.3 18.75,38.1 18.75,36.88 18.9,36.73 v19.36,36.73
PWR_BRD_TX  (via drill 0.2)
  Top 0.152: v12.19,40.84 3.03,40.84 PWR_BRD1.4 | v19.36,35.97 22.07,33.25 PROCESSOR_2.PC6
  Bottom 0.152: v12.19,40.84 15.54,40.84 18.44,37.95 18.44,36.73 19.2,35.97 v19.36,35.97
SD_CLK  (via drill 0.2)
  Top 0.152: PROCESSOR_2.PC12 23.75,39.3 23.47,39.01 v23.47,37.95
  Bottom 0.152: v23.47,37.95 22.4,37.95 21.95,38.41 21.95,40.84 21.64,41.15 21.03,41.15 20.6,41.58 U$2.5 20.75,47.73 21.34,48.31 30.94,48.31 31.55,47.7 31.55,45.41 32.46,44.5 35.36,44.5 35.63,44.78 RN1.6
SD_CMD  (via drill 0.2)
  Top 0.152: PROCESSOR_2.PD2 23.25,39.4 v22.86,39.01
  Bottom 0.152: v22.86,39.01 22.8,39.07 U$2.3
SD_D0  (via drill 0.2)
  Top 0.152: v19.36,37.49 22.59,34.25 PROCESSOR_2.PC8
  Bottom 0.152: v19.36,37.49 19.36,39.01 18.4,39.97 U$2.7 18.4,47.97 19.05,48.62 31.09,48.62 31.85,47.85 31.85,45.57 32.61,44.81 33.98,44.81 34.37,45.19 RN1.7
SD_D1  (via drill 0.2)
  Top 0.152: v18.75,38.86 22.86,34.75 PROCESSOR_2.PC9
  Bottom 0.152: v18.75,38.86 17.3,40.31 U$2.8 17.3,44.27 17.53,44.5 17.53,48.31 18.14,48.92 31.24,48.92 32.16,48.01 32.16,46.87 RN1.8
SD_D2  (via drill 0.2)
  Top 0.152: PROCESSOR_2.PC10 24.75,38.95 v24.99,38.71
  Bottom 0.152: v24.99,38.71 v25,38.72 U$2.1 24.99,43.59 25.3,43.89 35.05,43.89 35.94,43 R16.1
SD_D3  (via drill 0.2)
  Top 0.152: PROCESSOR_2.PC11 24.25,39.03 v23.93,38.71
  Bottom 0.152: v23.93,38.71 23.9,38.74 U$2.2 23.93,42.27 23.93,47.4 24.54,48.01 30.79,48.01 31.24,47.55 31.24,45.26 32.31,44.2 36.58,44.2 36.91,44.52 RN1.5
SER_FROM_ODROID  (via drill 0.2)
  Top 0.152: PROCESSOR_1.PA10 17.8,14.75 v18.14,15.09 | v14.17,5.79 14.17,5.33 13.72,4.88 13.01,4.88 R27.1 10.98,4.89 10,3.9 Q3.3 7.56,3.9 TP9.TP
  Bottom 0.152: v18.14,15.09 17.83,14.78 14.17,14.78 13.56,14.17 13.56,6.4 v14.17,5.79
SER_TO_ODROID  (via drill 0.2)
  Top 0.152: v13.26,15.24 PROCESSOR_1.PA9 | v11.89,10.36 11.12,9.6 TP10.TP
  Bottom 0.152: CON_ODROID1.2 11.25,9.73 v11.89,10.36 R32.1 | v13.26,15.24 12.04,15.24 11.89,15.09 R32.1 | R32.1
SLAVE_CLK  (via drill 0.2)
  Top 0.152: PROCESSOR_1.PA8 14.73,15.75 v14.48,16 | v12.95,29.41 12.95,35.66 14.04,36.75 14.94,36.75 | 14.94,36.75 PROCESSOR_2.PH0 | TP4.TP 14.94,36.75
  Bottom 0.152: v14.48,16 14.48,27.89 v12.95,29.41
SND_SIG  (via drill 0.2)
  Top 0.152: TP11.TP 35.2,28.04 v35.89,28.04
  Bottom 0.152: U$1.P$2 35.89,24.61 R6.1 v35.89,28.04 R14.1
SND_SIG_1  (via drill 0.2)
  Top 0.152: PROCESSOR_2.PA4 19.75,28.1 20.42,27.43 22.1,27.43 22.55,26.98 31.7,26.98 32.16,27.43 v32.46,27.43
  Bottom 0.152: v32.46,27.43 32.92,27.43 33.35,27 R6.2
SND_SIG_2  (via drill 0.2)
  Top 0.152: PROCESSOR_2.PA5 20.25,28.21 20.73,27.74 22.25,27.74 22.71,27.28 26.36,27.28 28.04,28.96 v32.46,28.96
  Bottom 0.152: R14.2 32.51,29 v32.46,28.96
SWCLK_P1
  Top 0.152: PROCESSOR_1.PA14 18.25,8.72 18.59,8.38 20.73,8.38 21.34,7.77 X1.3
SWCLK_P2
  Top 0.152: X4.3 22.62,43.52 23.32,42.82 25.15,42.82 25.75,42.22 PROCESSOR_2.PA14
SWDIO_P1  (via drill 0.2)
  Top 0.152: PROCESSOR_1.PA13 18.13,13.25 v18.14,13.26 | v19.2,7.77 20.09,6.89 X1.2
  Bottom 0.152: v18.14,13.26 18.14,8.84 v19.2,7.77
SWDIO_P2
  Top 0.152: X4.2 23.88,43.49 24.23,43.13 25.3,43.13 26.21,42.22 26.21,38.41 26.87,37.75 PROCESSOR_2.PA13
TRACESWO_P1
  Top 0.152: PROCESSOR_1.PB3 21.25,8.47 21.64,8.08 21.64,7.32 21.95,7.01 22.25,7.01 22.59,6.68 X1.4
TRACESWO_P2
  Top 0.152: X4.4 21.38,43.4 21.64,43.13 22.4,43.13 22.75,42.78 PROCESSOR_2.PB3
TX_ODROID
  Top 0.152: CON_ODROID1.3 6.63,12.27 7.01,11.89 7.01,8.08 8.05,7.04 Q3.2
USB_DM  (via drill 0.2)
  Top 0.152: USB_PROT.P$6 13.29,20 v13.41,20.12
  Top 0.254: PROCESSOR_1.PA11 14.71,14.25 TP2.TP 12.65,14.48 12.19,14.94 v12.19,16.92 | X3.2 11.08,24.28 v11.12,24.23
  Bottom 0.152: v13.41,20.12 12.34,20.12 12.04,19.81
  Bottom 0.254: v11.12,24.23 11.12,23.16 10.97,23.01 10.97,20.88 12.04,19.81 12.04,17.07 v12.19,16.92
USB_DP  (via drill 0.2)
  Top 0.152: USB_PROT.P$3 10.77,19 v10.52,18.75
  Top 0.254: PROCESSOR_1.PA12 14.66,13.75 TP1.TP 12.34,13.56 11.58,14.33 v11.58,16.46 | X3.3 10.51,23.48 v10.52,23.47
  Bottom 0.152: v10.52,18.75 11.58,18.75
  Bottom 0.254: v10.52,23.47 10.52,20.73 11.58,19.66 11.58,18.75 v11.58,16.46
USB_ID
  Top 0.152: X3.4 10.24,22.68 10.52,22.4 10.52,20.42 10.94,20 USB_PROT.P$1
USB_VBUS
  Top 0.152: X3.1 11.5,25.08 11.73,24.84 11.73,19.81 12.05,19.5 USB_PROT.P$5
USR_BTN1_A  (via drill 0.2)
  Top 0.152: PROCESSOR_1.PB5 22.25,8.38 23.16,7.47 35.66,7.47 36.12,7.01 36.12,5.49 v37.34,4.27 37.62,3.98 X2.9
  Bottom 0.152: v37.34,4.27 36.58,4.27 36,4.84 R38.2
USR_BTN1_K  (via drill 0.2)
  Top 0.152: PROCESSOR_1.PB4 21.75,8.43 23.01,7.16 31.24,7.16 v32.31,6.1 | v35.36,3.96 36.38,2.94 X2.10
  Bottom 0.152: v35.36,3.96 34,5.32 R33.1 33.98,6.1 v32.31,6.1
USR_BTN2_A  (via drill 0.2)
  Top 0.152: PROCESSOR_1.PB7 23.25,8.6 23.77,8.08 39.47,8.08 40.08,7.47 v40.08,4.27 40.12,4.22 X2.7
  Bottom 0.152: v40.08,4.27 40,4.35 R37.2
USR_BTN2_K  (via drill 0.2)
  Top 0.152: PROCESSOR_1.PB6 22.75,8.49 23.47,7.77 38.1,7.77 38.71,7.16 v38.71,4.27 38.88,4.1 X2.8
  Bottom 0.152: v38.71,4.27 38.41,4.27 38,4.67 R12.1
USR_BTN3_A  (via drill 0.2)
  Top 0.152: PROCESSOR_1.PB14 18.13,18.75 19.81,17.07 23.16,17.07 23.62,17.53 24.08,17.53 24.38,17.22 24.38,13.41 26.82,10.97 26.82,9.14 27.28,8.69 41.91,8.69 42.98,7.62 v42.98,4.27 42.62,3.92 X2.5
  Bottom 0.152: v42.98,4.27 43.59,4.27 44,4.68 R36.2
USR_BTN3_K  (via drill 0.2)
  Top 0.152: PROCESSOR_1.PB9 24.75,8.78 25.15,8.38 41,8.38 41.76,7.62 v41.76,4.27 41.38,3.88 X2.6
  Bottom 0.152: v41.76,4.27 42,4.51 R11.1
USR_BTN4_A  (via drill 0.2)
  Top 0.152: PROCESSOR_1.PB12 18.05,19.75 20.12,17.68 22.86,17.68 23.32,18.14 24.38,18.14 24.99,17.53 24.99,13.72 27.43,11.28 27.43,9.6 27.74,9.3 44.65,9.3 46.33,7.62 v46.33,4.27 45.41,4.27 45.12,3.98 X2.3
  Bottom 0.152: v46.33,4.27 47.09,4.27 48,5.18 R35.2
USR_BTN4_K  (via drill 0.2)
  Top 0.152: PROCESSOR_1.PB13 18.09,19.25 19.96,17.37 23.01,17.37 23.47,17.83 24.23,17.83 24.69,17.37 24.69,13.56 27.13,11.12 27.13,9.45 27.58,8.99 42.98,8.99 44.35,7.62 v44.35,4.27 43.88,3.79 X2.4
  Bottom 0.152: v44.35,4.27 45.41,4.27 46,4.85 R8.1
USR_BTN5_A  (via drill 0.2)
  Top 0.152: PROCESSOR_1.PB0 21.25,20.66 21.49,20.42 v22.55,20.42 | v22.55,18.14 22.71,18.14 23.01,18.44 24.54,18.44 25.3,17.68 25.3,14.48 v25.76,14.02 | v30.48,13.41 30.02,12.95 30.02,10.36 30.48,9.91 47.7,9.91 48.77,8.84 v48.77,2.59 48.77,1.83 48.44,1.5 X2.1
  Bottom 0.152: v48.77,2.59 50.9,2.59 52,3.69 R34.2 | v22.55,20.42 v22.55,18.14 | v25.76,14.02 29.87,14.02 v30.48,13.41
USR_BTN5_K  (via drill 0.2)
  Top 0.152: PROCESSOR_1.PC15 29.38,13.75 29.72,13.41 29.72,10.21 30.33,9.6 46.18,9.6 48.16,7.62 v48.16,4.27 47.09,4.27 46.38,3.55 X2.2
  Bottom 0.152: v48.16,4.27 49.38,4.27 50,4.89 R1.1
V_SAFETY_REF  (via drill 0.2)
  Top 0.152: v47.4,29.87 47.4,33.62 46.7,34.32 D1.C 46.7,36.03 46.94,36.27 47.55,36.27 47.79,36.52 C11.1 47.79,39.23 47.4,39.62 46.79,39.62 46.11,40.3 R18.2 | TP21.TP v49.23,10.36
  Bottom 0.152: 47.4,19.05 47.4,23.01 | 47.4,23.01 47.4,26.98 | IC1.3 47.66,31.05 47.4,30.79 v47.4,29.87 47.4,26.98 | IC7.3 48.23,26.98 47.4,26.98 | IC6.3 48.27,23.01 47.4,23.01 | IC5.3 47.4,19.05 | 47.4,15.09 47.4,11.28 47.62,11.05 IC4.3 48.99,10.36 v49.23,10.36 | 47.4,15.09 47.4,19.05 | IC3.3 47.43,15.05 47.4,15.09
VCC  (via drill 0.2)
  Top 0.152: PROCESSOR_2.VBAT 15.2,38.75 v15.09,38.86 | PROCESSOR_2.VDD3 18.25,42.25 17.98,42.52 v16.46,42.52 | X4.6 16.92,44.5 v16.46,44.04 | PROCESSOR_2.VDD2 27.75,39.18 v27.89,39.32 28,39.43 C5.1 | IC13.8 50.07,31.63 v50.29,31.85 | IC2.8 51.53,23.91 v51.66,23.77 | IC12.8 50.07,17.46 v50.29,17.68 | C17.1 15.03,9.21 v15.24,8.99 | R27.2 11.95,3.11 v11.89,3.05 | PROCESSOR_1.VDD2 16.25,11.94 v16.46,11.73 | PROCESSOR_2.VDD1 26.22,29.25 v26.36,29.11 | PROCESSOR_2.VDDA 15.38,32.75 v15.09,32.46 | PROCESSOR_2.VDD 19.25,30.22 v19.36,30.33 | R17.1 16.16,25 v16.31,25.15 | PROCESSOR_1.VDD1 18.25,22.75 v18.14,22.86 | PROCESSOR_1.VDD 24.75,20.82 v24.99,20.57 | PROCESSOR_1.VDDA 26.63,18.25 v26.52,18.14 | PROCESSOR_1.VDD3 25.75,9.15 v25.91,8.99 | X1.6 25.09,3.14 v24.84,2.9 | PROCESSOR_1.VBAT 27.75,11.57 v28.5,10.82
  Route2 0.152: v15.09,38.86 15.09,39.01 | v16.46,42.52 16.31,42.52 | v16.46,44.04 16.31,44.04 | v21.79,46.18 21.79,46.33 | v27.89,39.32 28.19,39.32 | v38.1,48.01 38.25,47.85 | v38.71,44.04 38.71,44.2 | v52.58,38.56 52.88,38.56 | v50.29,31.85 50.44,31.85 | v51.66,23.77 51.66,23.62 | v50.29,17.68 50.6,17.68 | v15.24,8.99 15.24,8.84 | v11.89,3.05 11.73,3.05 | v16.46,11.73 16.31,11.73 | v41,31.55 41,31.39 | v26.36,29.11 26.36,28.96 | v32.46,28.04 32.46,28.19 | v15.09,32.46 14.94,32.46 | v19.36,30.33 19.51,30.33 | v16.31,25.15 16.46,25.15 | v18.14,22.86 17.98,22.86 | v24.99,20.57 24.84,20.57 | v26.52,18.14 26.52,18.29 | v25.91,8.99 26.06,8.99 | v24.84,2.9 24.69,2.9 | v38.86,29.11 38.56,29.11 | v41.45,25.45 41.3,25.45 | 38.25,9.3 38.1,9.3 | v41.45,18.44 41.45,18.59 | v37.95,10.52 38.1,9.75 | v19.51,20.42 19.2,20.42
  Bottom 0.152: U$2.4 21.7,46.08 v21.79,46.18 | RN1.1 RN1.2 RN1.3 RN1.4 38.04,48.07 v38.1,48.01 | R16.2 38.89,43.86 v38.71,44.04 | RN6.4 52.4,38.38 v52.58,38.56 | U$7.P$5 41.4,32.41 41,32 v41,31.55 | v32.46,28.04 32.42,28 R10.2 R9.2 | R23.1 38.97,29 v38.86,29.11 | RN4.4 41.5,25.4 v41.45,25.45 | RN5.4 41.49,18.4 v41.45,18.44 | R33.2 R38.1 R12.2 | R12.2 R37.1 R11.2 R36.1 R8.2 R35.1 R1.2 R34.1 | R12.2 37.95,7.94 v37.95,10.52 | C2.1 19.79,20.14 v19.51,20.42 | C3.1 12.93,38.86 v15.09,38.86 | C1.1 28.21,10.53 v28.5,10.82
  Bottom 0.254: BLUBB.3 13.77,29.97 14.17,29.57 v14.78,29.57 v15.39,29.57
  pour Route2 (isolate 0.152): 1,1 59,1 59,49 1,49
VCC_5V  (via drill 0.2)
  Route2 0.152: U$1.P$1 28.6,22 25.15,25.45 18.59,25.45 17.83,26.21 17.83,26.98 16.92,27.89 14.63,27.89 14.02,28.5 v14.02,37.95
  Bottom 0.152: v14.02,37.95 13.77,37.7 BLUBB.1
  Bottom 0.508: PWR_BRD1.2 5.25,35.73 5.94,36.42 5.94,36.73 | 5.94,36.73 5.94,38.41 6.75,39.21 C15.1 | BLUBB.1 10.35,35.83 9.45,36.73 5.94,36.73
VCC_BAT  (via drill 0.2)
  Top 0.152: TP22.TP 53.65,11.89 54.03,12.27 DYNAMIXEL_RIGHT_LEG.3
  Route2 0.762: 53.95,35.51 53.95,25.3 | 53.95,25.3 53.95,12.67 54.35,12.27 DYNAMIXEL_RIGHT_LEG.3 | 53.95,35.51 v50.14,35.51 v49.38,35.51 v48.62,35.51 | DYNAMIXEL_LEFT_LEG.3 53.98,25.27 53.95,25.3 | 53.95,35.51 53.95,37.95 54.27,38.27 DYNAMIXEL_TORSO.3
  Bottom 0.762: v50.14,35.51 v49.38,35.51 v48.62,35.51 48.07,35.51 48.03,35.47 U$6.P5 U$6.P6 U$6.P7 U$6.P8
VCC_BAT_PRE  (via drill 0.2)
  Top 0.152: R13.2 43.98,41.91 45.11,41.91 D2.A 46.2,43.26 v45.11,44.35
  Route2 0.152: v46.02,11.89 v46.02,15.85 v46.02,19.96 v46.02,23.93 v46.02,28.04 v45.41,33.83 45.87,33.98 45.87,43.59 v45.11,44.35
  Bottom 0.152: IC1.5 45.73,32.92 45.73,33.53 v45.41,33.83 | IC7.5 45.69,28.37 v46.02,28.04 | IC6.5 45.69,24.26 v46.02,23.93 | IC5.5 45.69,20.3 v46.02,19.96 | IC3.5 45.69,16.18 v46.02,15.85 | IC4.5 45.69,12.22 v46.02,11.89
  Bottom 0.762: 45.87,40.53 45.87,43.59 | 45.87,43.59 45.82,43.59 | DYNAMIXEL_PWR.3 43.73,45.73 v45.11,44.35 45.87,43.59 | U$6.P3 45.87,40.53 | U$6.P1 U$6.P2 45.87,40.53
VCC_ODROID  (via drill 0.2)
  Top 0.152: CON_ODROID1.4 7.44,14.81 8,14.25 v8,14.17 R26.1
  Bottom 0.152: R32.2 8.17,14 v8,14.17

## Text on the board
Top: mtr / pwr | pwrbrd | torso | left leg | right leg | main cpu